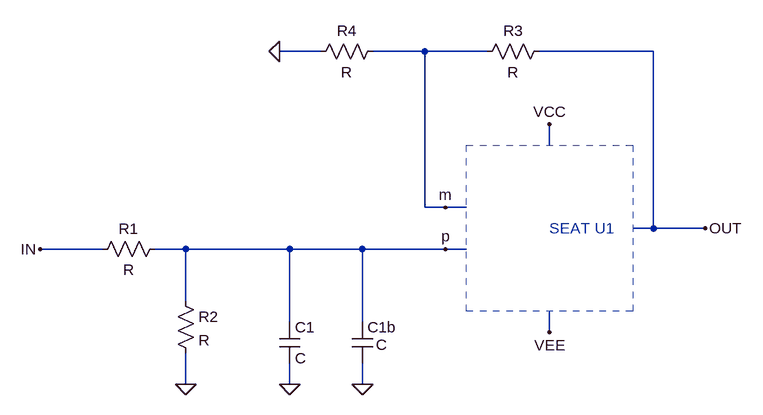
[diagram p0: schematic FO_LP_ni.asc]
FO_LP_ni.asc, the LTspice schematic file:
Version 4.1
SHEET 1 980 680
WIRE 320 -64 256 -64
WIRE 480 -64 400 -64
WIRE 576 -64 480 -64
WIRE 832 -64 656 -64
WIRE 672 80 672 48
WIRE 480 176 480 -64
WIRE 512 176 480 176
WIRE 544 176 512 176
WIRE 832 208 832 -64
WIRE 832 208 800 208
WIRE 912 208 832 208
WIRE -16 240 -112 240
WIRE 112 240 64 240
WIRE 272 240 112 240
WIRE 384 240 272 240
WIRE 512 240 384 240
WIRE 544 240 512 240
WIRE 112 320 112 240
WIRE 272 352 272 240
WIRE 384 352 384 240
WIRE 672 368 672 336
WIRE 112 448 112 400
WIRE 272 448 272 416
WIRE 384 448 384 416
FLAG 912 208 OUT
FLAG 672 48 VCC
FLAG 672 368 VEE
FLAG 512 176 m
FLAG 512 240 p
FLAG -112 240 IN
FLAG 112 448 0
FLAG 272 448 0
FLAG 256 -64 0
FLAG 384 448 0
SYMBOL res 80 224 R90
WINDOW 0 0 56 VBottom 2
WINDOW 3 32 56 VTop 2
SYMATTR InstName R1
SYMBOL res 672 -80 R90
WINDOW 0 0 56 VBottom 2
WINDOW 3 32 56 VTop 2
SYMATTR InstName R3
SYMBOL res 96 304 R0
SYMATTR InstName R2
SYMBOL res 416 -80 R90
WINDOW 0 0 56 VBottom 2
WINDOW 3 32 56 VTop 2
SYMATTR InstName R4
SYMBOL cap 368 352 R0
WINDOW 3 37 35 Left 2
SYMATTR InstName C1b
SYMBOL cap 256 352 R0
SYMATTR InstName C1
TEXT 672 208 Left 2 ;SEAT U1
RECTANGLE Normal 544 80 800 336 2

The netlist it stands for:
* FO_LP_ni.asc
R1 p IN R
R3 OUT m R
R2 p 0 R
R4 m 0 R
C1b p 0 C
C1 p 0 C
* SEAT U1
.backanno
.end